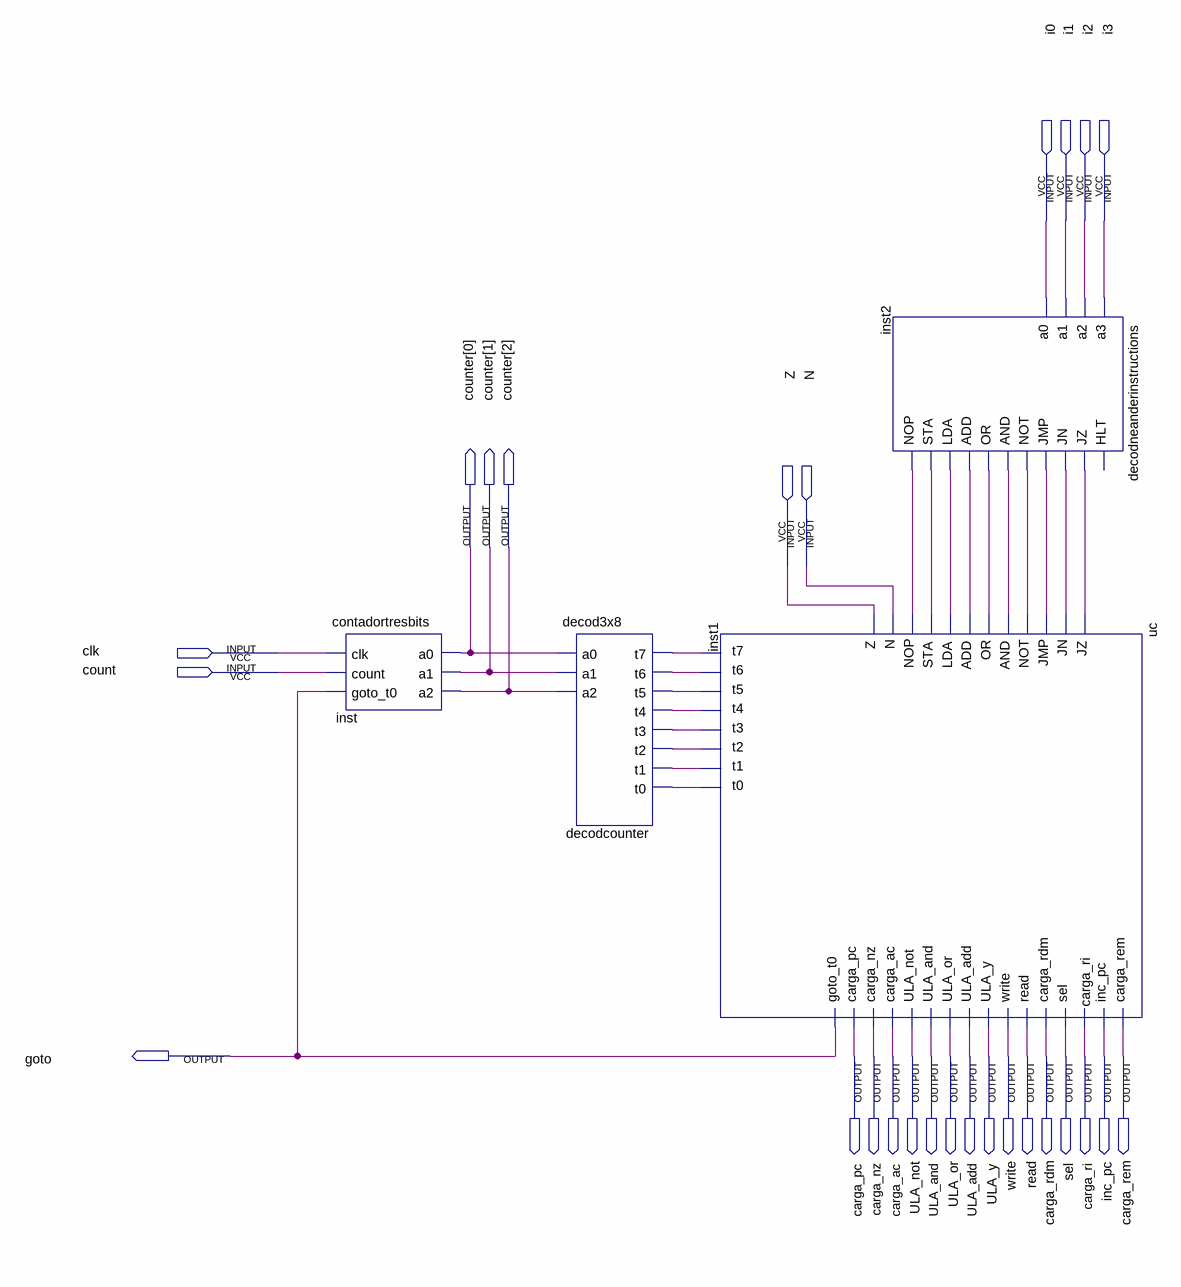
[diagram p0: schematic sheet]
// Quartus schematic partedecontrole.bdf as structural Verilog: 4 symbols, 27 pins
module partedecontrole (
  input  i0,
  input  i1,
  input  i2,
  input  i3,
  input  Z,
  input  N,
  input  clk,
  input  count,
  output [2:0] counter,
  output goto,
  output carga_pc,
  output carga_nz,
  output carga_ac,
  output ULA_not,
  output ULA_and,
  output ULA_or,
  output ULA_add,
  output ULA_y,
  output write,
  output read,
  output carga_rdm,
  output sel,
  output carga_ri,
  output inc_pc,
  output carga_rem
);

  wire decodcounter_t0, decodcounter_t1, decodcounter_t2, decodcounter_t3, decodcounter_t4, decodcounter_t5,
       decodcounter_t6, decodcounter_t7, inst2_add, inst2_and, inst2_jmp, inst2_jn, inst2_jz, inst2_lda,
       inst2_nop, inst2_not, inst2_or, inst2_sta;

  contadortresbits inst (.clk(clk), .goto_t0(goto), .count(count), .a0(counter[0]), .a1(counter[1]), .a2(counter[2]));
  decod3x8 decodcounter (
    .a1(counter[1]), .a0(counter[0]), .a2(counter[2]), .t7(decodcounter_t7), .t6(decodcounter_t6),
    .t5(decodcounter_t5), .t4(decodcounter_t4), .t3(decodcounter_t3), .t2(decodcounter_t2),
    .t1(decodcounter_t1), .t0(decodcounter_t0));
  uc inst1 (
    .STA(inst2_sta), .LDA(inst2_lda), .ADD(inst2_add), .OR(inst2_or), .AND(inst2_and), .N(N), .Z(Z),
    .JMP(inst2_jmp), .JN(inst2_jn), .JZ(inst2_jz), .t3(decodcounter_t3), .t4(decodcounter_t4),
    .t5(decodcounter_t5), .t6(decodcounter_t6), .t7(decodcounter_t7), .NOT(inst2_not), .NOP(inst2_nop),
    .t1(decodcounter_t1), .t0(decodcounter_t0), .t2(decodcounter_t2), .carga_rem(carga_rem), .inc_pc(inc_pc),
    .sel(sel), .carga_rdm(carga_rdm), .read(read), .write(write), .ULA_y(ULA_y), .ULA_add(ULA_add),
    .ULA_or(ULA_or), .ULA_and(ULA_and), .ULA_not(ULA_not), .carga_ac(carga_ac), .carga_nz(carga_nz),
    .carga_pc(carga_pc), .goto_t0(goto), .carga_ri(carga_ri));
  decodneanderinstructions inst2 (
    .a3(i3), .a2(i2), .a1(i1), .a0(i0), .JZ(inst2_jz), .JN(inst2_jn), .JMP(inst2_jmp), .NOT(inst2_not),
    .AND(inst2_and), .OR(inst2_or), .ADD(inst2_add), .LDA(inst2_lda), .STA(inst2_sta), .NOP(inst2_nop));  // open: HLT
endmodule
